# EAGLE design ext_pcb (EAGLE 7.4.0)
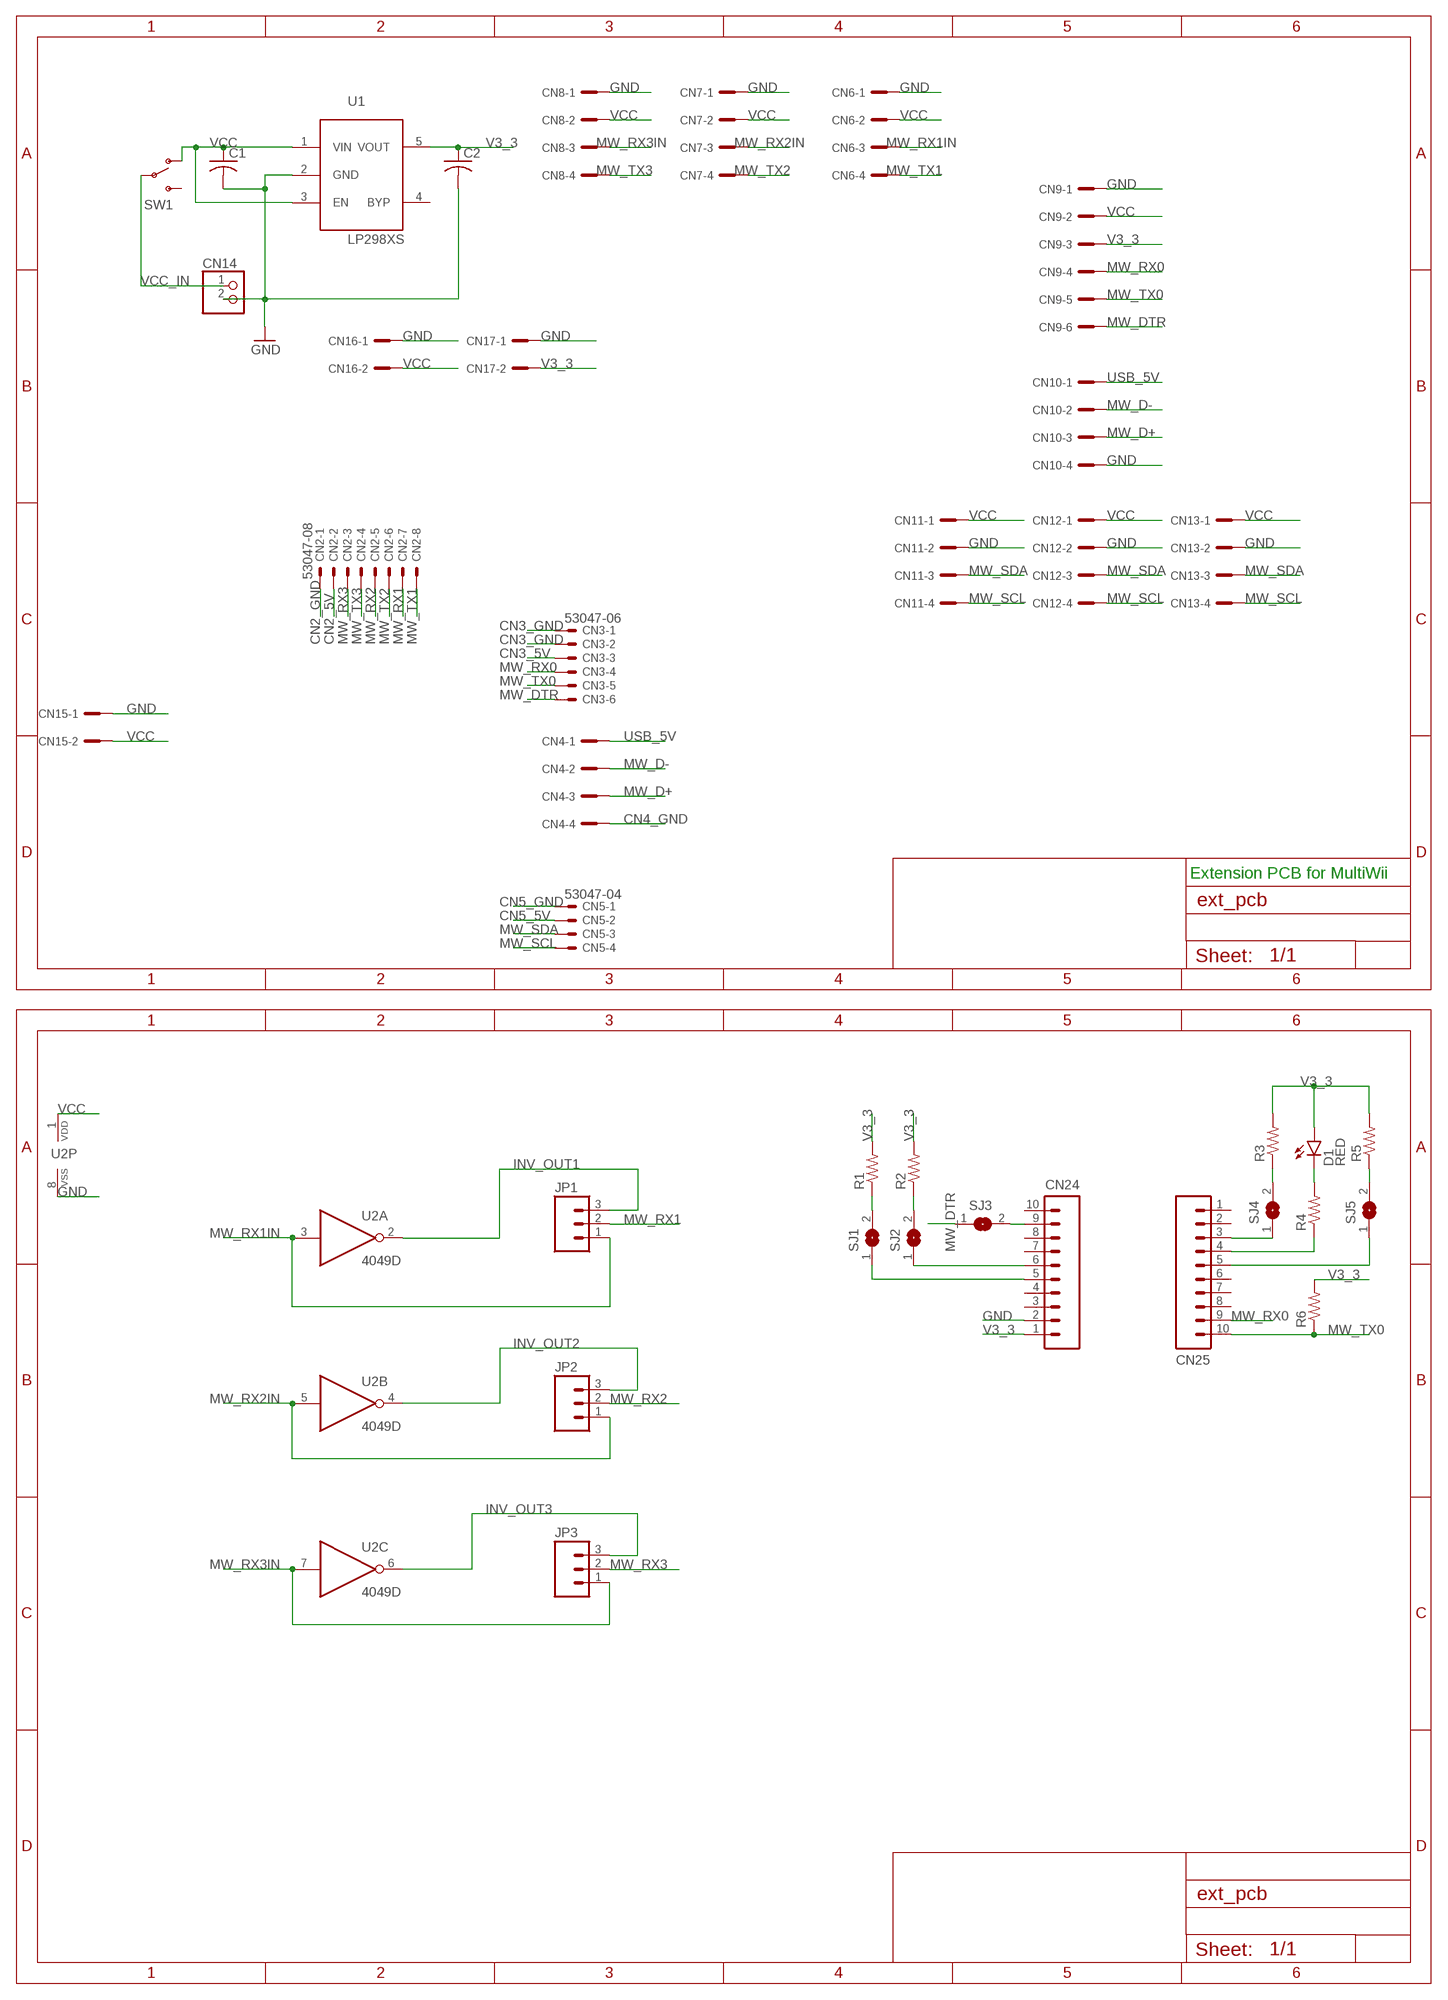
[diagram p0: schematic, sheet 1]

## Parts
C1  C-USC0805  [C0805]
C2  C-USC0805  [C0805]
CN2  53047-08  [53047-08]
CN3  53047-06  [53047-06]
CN4  MCV_05/4-G-2,5V  [MCV4]
CN5  53047-04  [53047-04]
CN6  MCV_05/4-G-2,5V  [MCV4]
CN7  MCV_05/4-G-2,5V  [MCV4]
CN8  MCV_05/4-G-2,5V  [MCV4]
CN9  MCV_05/6-G-2,5V  [MCV6]
CN10  MCV_05/4-G-2,5V  [MCV4]
CN11  MCV_05/4-G-2,5V  [MCV4]
CN12  MCV_05/4-G-2,5V  [MCV4]
CN13  MCV_05/4-G-2,5V  [MCV4]
CN14  PINHD-1X2  [1X02]
CN15  MCV_05/2-G-2,5V  [MCV2]
CN16  MCV_05/2-G-2,5V  [MCV2]
CN17  MCV_05/2-G-2,5V  [MCV2]
CN24  M10SILK_FEMALE_PTH  [1X10]
CN25  M10SILK_FEMALE_PTH  [1X10]
D1  RED  LED-RED1206  [LED-1206]
JP1  M03PTH  [1X03]
JP2  M03PTH  [1X03]
JP3  M03PTH  [1X03]
R1  RESISTOR0805-RES  [0805]
R2  RESISTOR0805-RES  [0805]
R3  RESISTOR0805-RES  [0805]
R4  RESISTOR0805-RES  [0805]
R5  RESISTOR0805-RES  [0805]
R6  RESISTOR0805-RES  [0805]
SJ1  SJW  [SJW]
SJ2  SJW  [SJW]
SJ3  SJW  [SJW]
SJ4  SJW  [SJW]
SJ5  SJW  [SJW]
SW1  SWITCH-SPDTPTH  [SWITCH-SPDT]
U1  LP298XS  [SOT23-5L]
U2  4049D  [SO16]

## Nets
CN2_5V: CN2.2
CN2_GND: CN2.1
CN3_5V: CN3.3
CN3_GND: CN3.1 CN3.2
CN4_GND: CN4.4
CN5_5V: CN5.2
CN5_GND: CN5.1
GND: C1.2 C2.2 CN6.1 CN7.1 CN8.1 CN9.1 CN10.4 CN11.2 CN12.2 CN13.2 CN14.2 CN15.1 CN16.1 CN17.1 CN24.2 U1.2(GND) U2.8(P:VSS)
INV_OUT1: JP1.3 U2.2(A:O)
INV_OUT2: JP2.3 U2.4(B:O)
INV_OUT3: JP3.3 U2.6(C:O)
MW_D+: CN4.3 CN10.3
MW_D-: CN4.2 CN10.2
MW_DTR: CN3.6 CN9.6 SJ3.1
MW_RX0: CN3.4 CN9.4 CN25.9
MW_RX1: CN2.7 JP1.2
MW_RX1IN: CN6.3 JP1.1 U2.3(A:I)
MW_RX2: CN2.5 JP2.2
MW_RX2IN: CN7.3 JP2.1 U2.5(B:I)
MW_RX3: CN2.3 JP3.2
MW_RX3IN: CN8.3 JP3.1 U2.7(C:I)
MW_SCL: CN5.4 CN11.4 CN12.4 CN13.4
MW_SDA: CN5.3 CN11.3 CN12.3 CN13.3
MW_TX0: CN3.5 CN9.5 CN25.10 R6.1
MW_TX1: CN2.8 CN6.4
MW_TX2: CN2.6 CN7.4
MW_TX3: CN2.4 CN8.4
N$1: CN24.9 SJ3.2
N$2: CN24.6 SJ2.1
N$3: CN24.5 SJ1.1
N$4: R1.1 SJ1.2
N$5: R2.1 SJ2.2
N$6: CN25.3 SJ4.1
N$7: R3.1 SJ4.2
N$8: D1.C R4.2
N$10: R5.1 SJ5.2
N$11: CN25.4 R4.1
N$12: CN25.5 SJ5.1
USB_5V: CN4.1 CN10.1
V3_3: C2.1 CN9.3 CN17.2 CN24.1 D1.A R1.2 R2.2 R3.2 R5.2 R6.2 U1.5(VOUT)
VCC: C1.1 CN6.2 CN7.2 CN8.2 CN9.2 CN11.1 CN12.1 CN13.1 CN15.2 CN16.2 SW1.1(O) U1.1(VIN) U1.3(EN) U2.1(P:VDD)
VCC_IN: CN14.1 SW1.2(P)
Unconnected: CN24.3 CN24.4 CN24.7 CN24.8 CN24.10 CN25.1 CN25.2 CN25.6 CN25.7 CN25.8 SW1.3(S) U1.4(BYP) U2.9(D:I) U2.10(D:O) U2.11(E:I) U2.12(E:O) U2.14(F:I) U2.15(F:O)

## Notes on the sheet
- Extension PCB for MultiWii

## Library data of the parts
C1 C2 = adafruit:C-US: CAPACITOR, American symbol
CN2 = con-molex:53?-08: CONNECTOR wire to board 1.25 mm (.049 inch) pitch header; MPN: 53047-0810; OC_FARNELL: 1012258; OC_NEWARK: 98K9826
CN3 = con-molex:53?-06: CONNECTOR wire to board 1.25 mm (.049 inch) pitch header; MPN: 53047-0610-C; OC_FARNELL: 9733078; OC_NEWARK: 03M2965
CN4 CN6-CN8 CN10-CN13 = con-phoenix-250:MCV_05/4-G-2,5: Mini-Combicon 2.50mm 4polig MC(V) 0,5/4-G-2,5
CN5 = con-molex:53?-04: CONNECTOR wire to board 1.25 mm (.049 inch) pitch header; MF: WALDOM/MOLEX; MPN: 53047-0410; OC_FARNELL: 9733060; OC_NEWARK: 38C9900
CN9 = con-phoenix-250:MCV_05/6-G-2,5: Mini-Combicon 2.50mm 6polig MC(V) 0,5/6-G-2,5
CN14 = pinhead:PINHD-1X2: PIN HEADER
CN15-CN17 = con-phoenix-250:MCV_05/2-G-2,5: Mini-Combicon 2.50mm 2polig MC(V) 0,5/2-G-2,5
CN24 CN25 = SparkFun-Connectors:M10: Header 10 Standard 10-pin 0.1" header. Use with straight break away headers (SKU : PRT-00116), right angle break away headers (PRT-00553), swiss pins (PRT-00743), machine pins (PRT-00117), and female headers (PRT-00115).; PROD_ID: CONN-11563
D1 = SparkFun-LED:LED-RED: Assorted Red LEDs LilyPad 1206- DIO-09912 1206- DIO-00809 0603- DIO-00819 "SMART" means more efficient and expensive; PROD_ID: DIO-09912
JP1-JP3 = SparkFun-Connectors:M03: Header 3 Standard 3-pin 0.1" header. Use with straight break away headers (SKU : PRT-00116), right angle break away headers (PRT-00553), swiss pins (PRT-00743), machine pins (PRT-00117), and female headers (PRT-00115). Molex polarized connector foot print use with SKU : PRT-08232 with associated crimp pins and housings.
R1-R6 = SparkFun-Resistors:RESISTOR: Resistor Basic schematic elements and footprints for 0603, 1206, and PTH resistors.
SJ1-SJ5 = jumper:SJ: SMD solder JUMPER
SW1 = SparkFun-Electromechanical:SWITCH-SPDT: SPDT Switch Simple slide switch, Spark Fun Electronics SKU : COM-00102 DPDT SMT slide switch, AYZ0202, SWCH-08179; PROD_ID: SWCH-08261
U1 = adafruit:LP298X
U2 = 40xx:4049: Hex inverting BUFFER

## Board
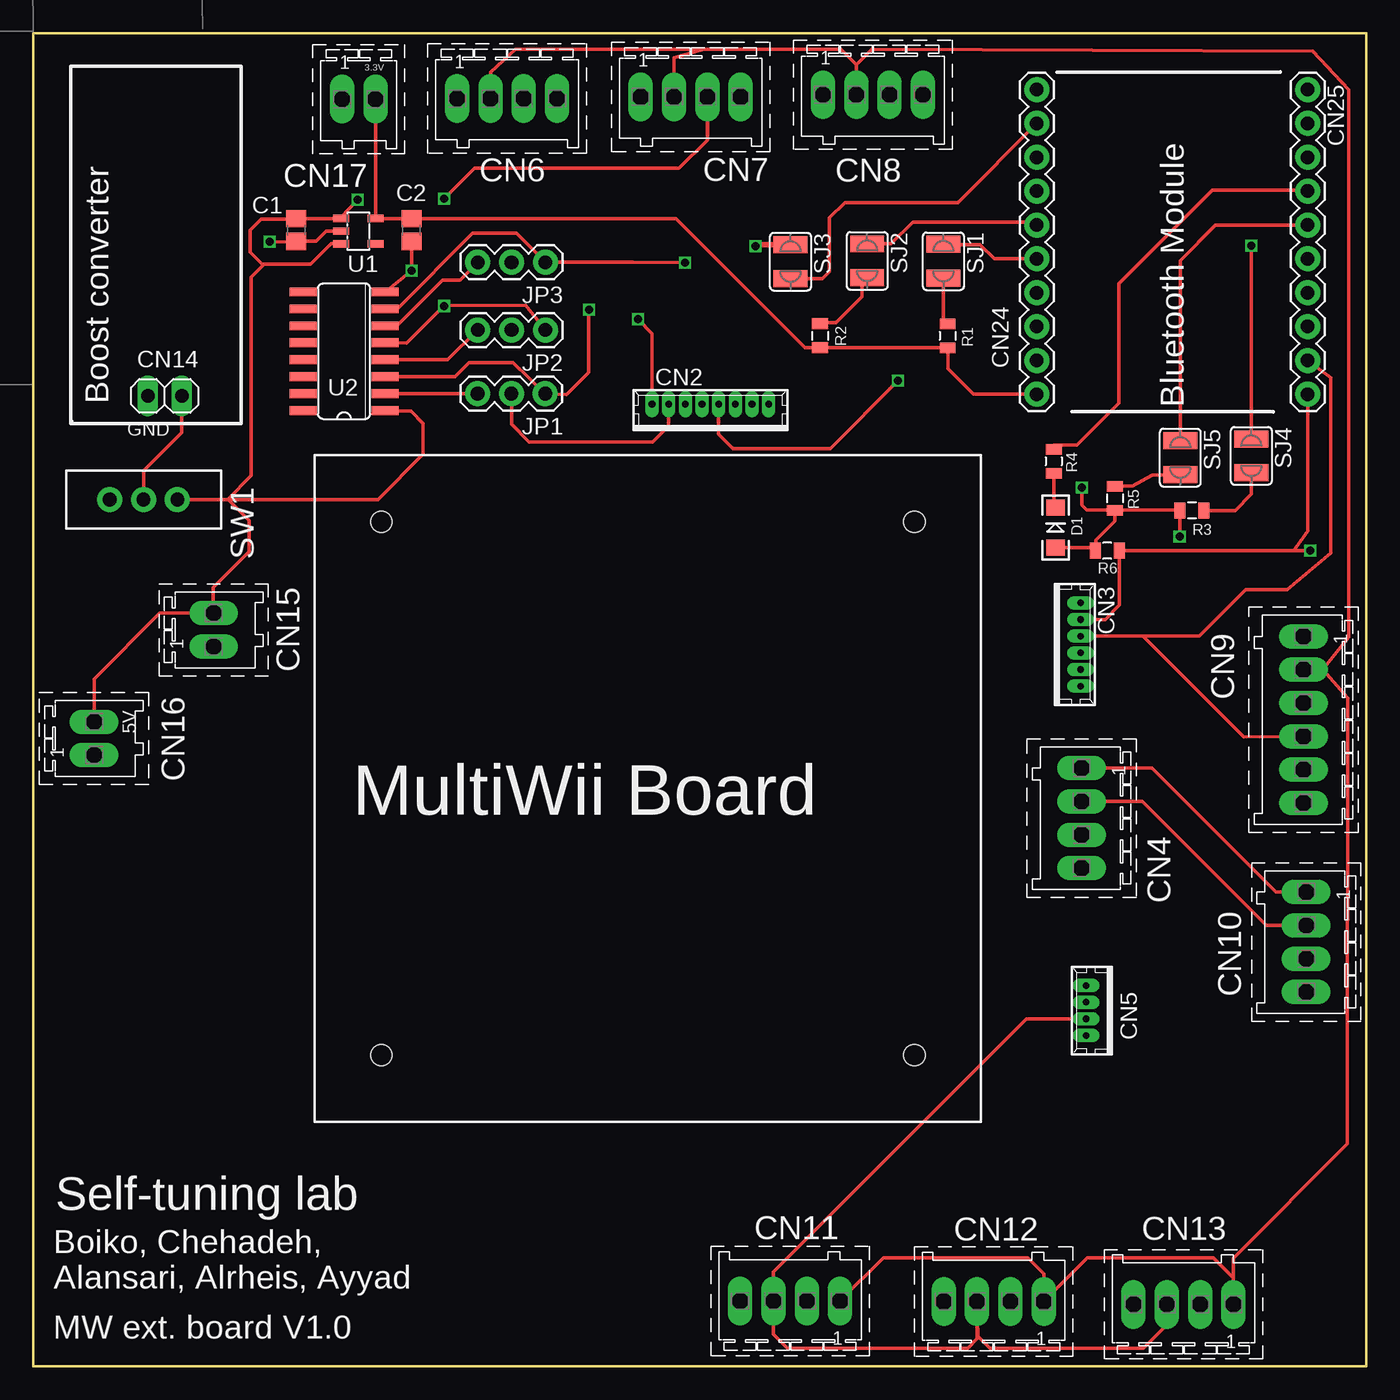
[diagram p1: board, top side]
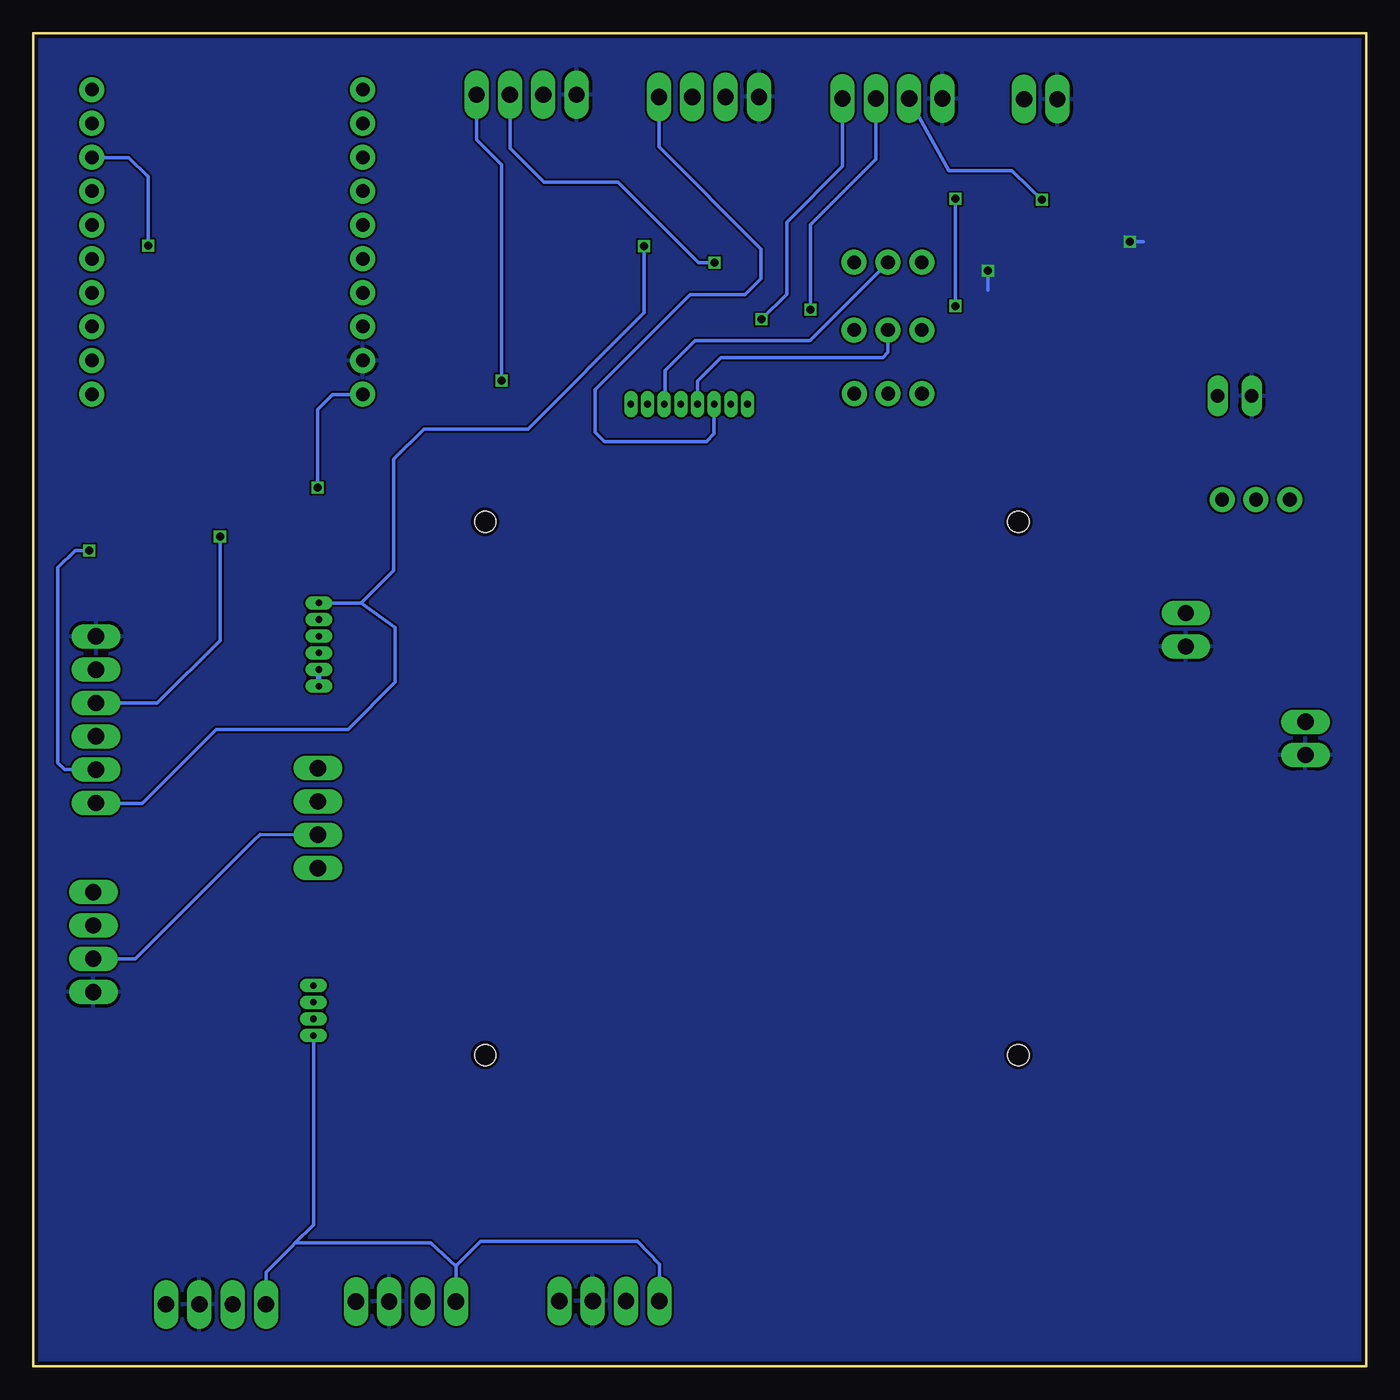
[diagram p2: board, bottom side, seen from below]

Size 100 x 100 mm. Coordinates in mm from the lower left corner, seen from the top.
Outline: 0,0 0,100 100,100 100,0 0,0
Copper layers (1*16): Top 0.035mm / dielectric 1.5mm / Bottom 0.035mm
Design rules "SeeedStudio_2layer_DRU_no_angle_20140221": minimum track width 6mil, minimum drill 12mil, track to track 6mil, track to pad 6mil, pad to pad 6mil, via to via 6mil, smd to smd 0mil, copper to edge 10mil, drill to drill 10mil, minimum pad ring 10mil, minimum via ring 6mil, stop-mask expansion 2mil, vias tented up to drill 100mil, thermal gap 10mil
Holes 1.6 mm at 66.1,23.35 26.1,63.35 66.1,63.35 26.1,23.35

### Footprints (pad centres in the part's own frame; a part is rotated, then mirrored left to right if it is on the bottom)
C0805 = smd 1.3 x 1.5: 1 -0.85,0; 2 0.85,0
53047-08 = drill 0.5 pad 0.698 long: 1 4.375,0.45; 2 3.125,0.45; 3 1.875,0.45; 4 0.625,0.45; 5 -0.625,0.45; 6 -1.875,0.45; 7 -3.125,0.45; 8 -4.375,0.45
53047-06 = drill 0.5 pad 0.698 long: 1 3.125,0.45; 2 1.875,0.45; 3 0.625,0.45; 4 -0.625,0.45; 5 -1.875,0.45; 6 -3.125,0.45
MCV4 = drill 1.22 pad 1.676 long: 1 -2.5,0; 2 0,0; 3 2.5,0; 4 5,0
53047-04 = drill 0.5 pad 0.698 long: 1 1.875,0.45; 2 0.625,0.45; 3 -0.625,0.45; 4 -1.875,0.45
MCV6 = drill 1.22 pad 1.676 long: 1 -5,0; 2 -2.5,0; 3 0,0; 4 2.5,0; 5 5,0; 6 7.5,0
1X02 = drill 1.016 long: 1 -1.27,0; 2 1.27,0
MCV2 = drill 1.22 pad 1.676 long: 1 0,0; 2 2.5,0
1X10 = drill 1.016 pad 1.88: 1 0,0; 2 2.54,0; 3 5.08,0; 4 7.62,0; 5 10.16,0; 6 12.7,0; 7 15.24,0; 8 17.78,0; 9 20.32,0; 10 22.86,0
LED-1206 = smd 1.2 x 1.4: A -1.5,0; C 1.5,0
1X03 = drill 1.016 pad 1.88: 1 0,0; 2 2.54,0; 3 5.08,0
0805 = smd 0.8 x 1.2: 1 -0.9,0; 2 0.9,0
SJW = smd 1.27 x 2.54: 1 -1.27,0; 2 1.27,0
SWITCH-SPDT = drill 1.016 pad 1.88: 1 0,2.54; 2 0,0; 3 0,-2.54
SOT23-5L = smd 0.55 x 1.2: 1 -0.95,-1.3; 2 0,-1.3; 3 0.95,-1.3; 4 0.95,1.3; 5 -0.95,1.3
SO16 = smd 0.66 x 2.032: 1 -4.445,-3.073; 2 -3.175,-3.073; 3 -1.905,-3.073; 4 -0.635,-3.073; 5 0.635,-3.073; 6 1.905,-3.073; 7 3.175,-3.073; 8 4.445,-3.073; 9 4.445,3.073; 10 3.175,3.073; 11 1.905,3.073; 12 0.635,3.073; 13 -0.635,3.073; 14 -1.905,3.073; 15 -3.175,3.073; 16 -4.445,3.073

### Placement (x,y rotation side)
C1  19.73,85.24 270 top
C2  28.37,85.24 270 top
CN2  50.79,71.73 0 top
CN3  78.13,54.14 270 top
CN4  78.65,42.37 270 top
CN5  79.43,26.68 90 top
CN6  34.29,95.11 0 top
CN7  48.06,95.23 0 top
CN8  61.74,95.39 0 top
CN9  95.29,49.76 270 top
CN10  95.5,33.07 270 top
CN11  58.03,4.89 180 top
CN12  73.3,4.86 180 top
CN13  87.54,4.64 180 top
CN14  9.87,72.8 180 top
CN15  13.53,54 90 top
CN16  4.56,45.85 90 top
CN17  23.17,95.06 0 top
CN24  75.29,72.92 90 top
CN25  95.61,95.78 270 top
D1  76.69,62.91 90 top
JP1  38.41,72.97 180 top
JP2  38.42,77.74 180 top
JP3  38.42,82.82 180 top
R1  68.6,77.3 270 top
R2  59.03,77.31 270 top
R3  86.92,64.21 180 top
R4  76.56,67.89 270 top
R5  81.15,65.12 270 top
R6  80.58,61.19 180 top
SJ1  68.28,82.9 270 top
SJ2  62.56,82.93 270 top
SJ3  56.81,82.87 270 top
SJ4  91.38,68.3 270 top
SJ5  86.05,68.17 270 top
SW1  8.27,65.02 270 top
U1  24.39,85.16 270 top
U2  23.32,76.15 90 top

### Tracks (layer width: path | path; a pad name or v marks a point on that pad's centre or on a via)
CN3_GND
  Bottom 0.406: CN3.1 CN3.2
GND  (via drill 0.6)
  Top 0.254: C2.2 v28.37,82.18 U2.8 | v17.72,84.36 19.76,84.34 19.76,84.36 C1.2 19.75,84.41 21.21,84.41 21.95,85.16 U1.2
  Bottom 0.254: v28.37,82.18 28.37,80.72 28.39,81.31 | v17.72,84.36 16.72,84.36
  pour Bottom: -18.57,111.11 115.16,111.1 115.22,-11.54 -18.65,-11.13 -18.81,111.05
INV_OUT1
  Top 0.254: U2.2 JP1.3
INV_OUT2
  Top 0.254: U2.4 31.07,75.52 JP2.3
INV_OUT3
  Top 0.254: U2.6 27.27,78.06 30.72,81.5 32.02,81.5 JP3.3
MW_D+
  Bottom 0.254: CN10.3 92.35,30.57 83.47,39.45 82.97,39.88 CN4.3
MW_D-
  Top 0.254: CN10.2 92.5,33.07 83.2,42.37 CN4.2
MW_DTR  (via drill 0.6)
  Top 0.406: SJ3.1 54.29,84.14 v54.18,84.03
  Bottom 0.254: v54.18,84.03 54.18,79.03 62.89,70.32 70.7,70.32 72.96,68.06 72.96,59.7 75.39,57.27 | CN3.6 75.39,57.27 | 75.39,57.27 72.84,55.43 72.84,51.33 76.39,47.78 86.28,47.78 91.83,42.23 95.26,42.23
  Bottom 0.406: 95.26,42.23 CN9.6
MW_RX0
  Top 0.254: CN3.4 83.23,54.77 | 83.23,54.77 90.81,47.19 95.22,47.25 CN9.4 | 83.23,54.77 87.48,54.77 90.98,58.26 94.08,58.26 97.33,61.01 97.33,74.16 CN25.9
MW_RX1
  Top 0.254: JP1.2 35.87,70.67 37.21,69.33 46.45,69.33 47.67,70.55 CN2.7
MW_RX1IN  (via drill 0.6)
  Top 0.254: U2.3 31.62,74.25 32.69,75.31 36,75.31 JP1.1 40,72.89 41.65,74.54 41.65,79.24 v41.68,79.27
  Bottom 0.254: v41.68,79.27 41.68,85.66 36.79,90.55 CN6.3
MW_RX2
  Bottom 0.254: JP2.2 35.88,76.07 36.27,75.68 48.4,75.68 50.17,73.91 CN2.5
MW_RX2IN  (via drill 0.6)
  Top 0.254: U2.5 28,76.75 30.82,79.57 | 30.82,79.57 36.92,79.6 JP2.1 | CN7.3 50.56,91.98 48.45,89.87 33.09,89.87 v30.81,87.59 | v30.83,79.55 30.76,79.65 30.82,79.57
  Bottom 0.254: v30.81,87.59 30.81,80.25 v30.83,79.55
MW_RX3
  Bottom 0.254: JP3.2 35.88,82.8 41.74,76.94 50.37,76.94 52.61,74.7 52.61,72.23 CN2.3
MW_RX3IN  (via drill 0.6)
  Top 0.254: U2.7 27.3,79.33 32.96,84.99 36.25,84.99 JP3.1 44.99,82.82 v48.88,82.8
  Bottom 0.254: v48.88,82.8 50.11,82.8 56.13,88.82 61.69,88.82 64.24,91.37 CN8.3
MW_SCL
  Bottom 0.254: CN13.4 82.54,7.04 80.54,9.04 80.34,9.24 | 80.34,9.24 70.19,9.24 68.3,7.49 CN12.4 68.3,7.53 66.45,9.38 54.66,9.38 53.03,7.64 CN11.4 | CN5.4 78.98,10.6 80.34,9.24
MW_SDA
  Top 0.254: CN13.3 85.04,3.1 83.27,1.33 71.78,1.33 70.88,2.23 70.79,4.78 CN12.3 70.8,2.04 70.12,1.36 56.58,1.36 55.53,2.41 CN11.3 55.53,7.07 74.52,26.06 CN5.3
  Bottom 0.254: CN5.3
MW_TX0  (via drill 0.6)
  Top 0.254: 78.59,56.03 80.42,56.03 81.48,57.09 R6.1 94.55,61.2 | 94.55,61.2 95.62,62.66 95.62,72.82 | v95.79,61.2 94.55,61.2
  Top 0.406: 78.59,56.03 CN3.5 | 95.62,72.82 CN25.10
  Bottom 0.254: CN9.5 97.66,44.76 98.17,45.27 98.17,59.91 96.87,61.21 v95.8,61.21 v95.79,61.2
MW_TX1  (via drill 0.6)
  Top 0.254: CN2.8 46.41,77.48 v45.36,78.54
  Bottom 0.254: v45.36,78.54 43.47,80.43 43.47,85.85 39.29,90.03 CN6.4
MW_TX2
  Bottom 0.254: CN2.6 48.91,69.95 49.49,69.38 57.14,69.38 57.86,70.1 57.86,73.26 50.73,80.39 46.61,80.39 45.39,81.61 45.39,83.82 53.06,91.49 CN7.4
MW_TX3  (via drill 0.6)
  Top 0.254: CN2.4 51.41,69.92 52.51,68.83 59.79,68.83 v64.88,73.96
  Bottom 0.254: v64.88,73.96 64.88,90.16 66.75,92.03 CN8.4
N$1
  Top 0.254: SJ3.2 59.21,81.6 59.74,82.13 59.74,86.15 60.89,87.3 69.35,87.3 CN24.9
N$2
  Top 0.254: SJ2.1 64.35,84.2 65.98,85.83 75.08,85.83 CN24.6
N$3
  Top 0.254: CN24.5 72.09,83.08 71.03,84.14 68.31,84.14 SJ1.1
N$4
  Top 0.254: SJ1.2 68.28,78.53 R1.1
N$5
  Top 0.254: SJ2.2 62.18,81.21 62.16,81.19 62.16,80.24 60.22,78.3 58.69,78.3 R2.1
N$6  (via drill 0.6)
  Top 0.254: SJ4.1 v91.38,84.06 v91.39,84.07
  Bottom 0.254: v91.39,84.07 91.39,89.23 92.84,90.68 95.59,90.68 CN25.3
N$7
  Top 0.254: R3.1 90.17,64.21 91.38,65.42 SJ4.2
N$8
  Top 0.254: R4.2 76.56,64.54 D1.C
N$10
  Top 0.254: R5.1 82.44,66.02 83.94,66.86 86.01,66.86 SJ5.2
N$11
  Top 0.254: R4.1 76.56,69.11 78.31,69.11 81.45,72.25 81.45,81.22 88.45,88.22 95.55,88.22 CN25.4
N$12
  Top 0.254: SJ5.1 86.05,82.96 88.68,85.59 95.58,85.59 CN25.5
USB_5V
  Top 0.254: CN10.1 93.23,35.57 83.92,44.88 CN4.1
V3_3  (via drill 0.6)
  Top 0.254: CN17.2 U1.5 28.36,86.11 C2.1 48.2,86.09 57.88,76.42 R2.2 R1.2 68.6,74.84 70.52,72.92 CN24.1 | D1.A 79.66,61.41 R6.2 79.73,61.24 79.73,61.98 81.15,63.4 R5.2 | R5.2 79.06,64.22 78.68,64.6 v78.68,65.91 | v86,62.25 86,64.19 R3.2 R5.2
  Bottom 0.254: CN9.3 90.7,49.76 86,54.46 v86,62.25 | v78.68,65.91 78.68,71.78 77.56,72.9 75.31,72.9 CN24.1
VCC  (via drill 0.6)
  Top 0.254: v24.32,87.51 23.09,86.2 U1.1 19.75,86.11 C1.1 19.71,86.07 17.09,86.07 16.34,85.32 16.34,85.29 16.28,85.23 16.28,83.58 17.18,82.68 17.32,82.68 | CN6.2 34.29,97.09 36.19,98.8 50.3,98.81 | 50.3,98.81 60.59,98.82 61.74,97.63 | 61.74,97.63 61.77,95.45 CN8.2 | CN7.2 48.05,98.19 50.3,98.81 | 96.74,52.26 98.6,50.14 98.57,16.67 90.04,8.09 CN13.1 90.04,6.62 88.53,8.13 79.07,8.13 CN12.1 75.8,6.95 74.62,8.13 63.77,8.13 CN11.1 | CN9.2 96.74,52.26 | 96.74,52.26 98.68,54.72 98.71,95.77 96,98.67 62.9,98.79 61.74,97.63 | SW1.1 14.57,65.03 | 14.57,65.03 20.83,65.03 25.86,65.03 29.26,68.43 29.26,70.72 28.33,71.65 26.44,71.65 U2.1 | U1.3 22.34,84.2 20.81,82.68 17.32,82.68 | 17.32,82.68 16.35,81.71 16.35,66.82 14.57,65.03 | 14.57,65.03 14.62,65.03 16.2,63.45 16.2,61.13 13.5,58.43 13.5,56.53 CN15.2 9.48,56.49 4.56,51.57 CN16.2
  Bottom 0.254: v24.32,87.51 25.27,88.43 26.59,89.68 31.3,89.68 CN6.2
VCC_IN
  Top 0.254: CN14.1 11.13,70.06 8.27,67.19 SW1.2
  Top 0.406: CN14.1

### Text on the board
tPlace: 3.3V | Boost converter | Bluetooth Module | GND | 5V | MultiWii Board | Self-tuning lab | Boiko, Chehadeh, / Alansari, Alrheis, Ayyad | MW ext. board V1.0